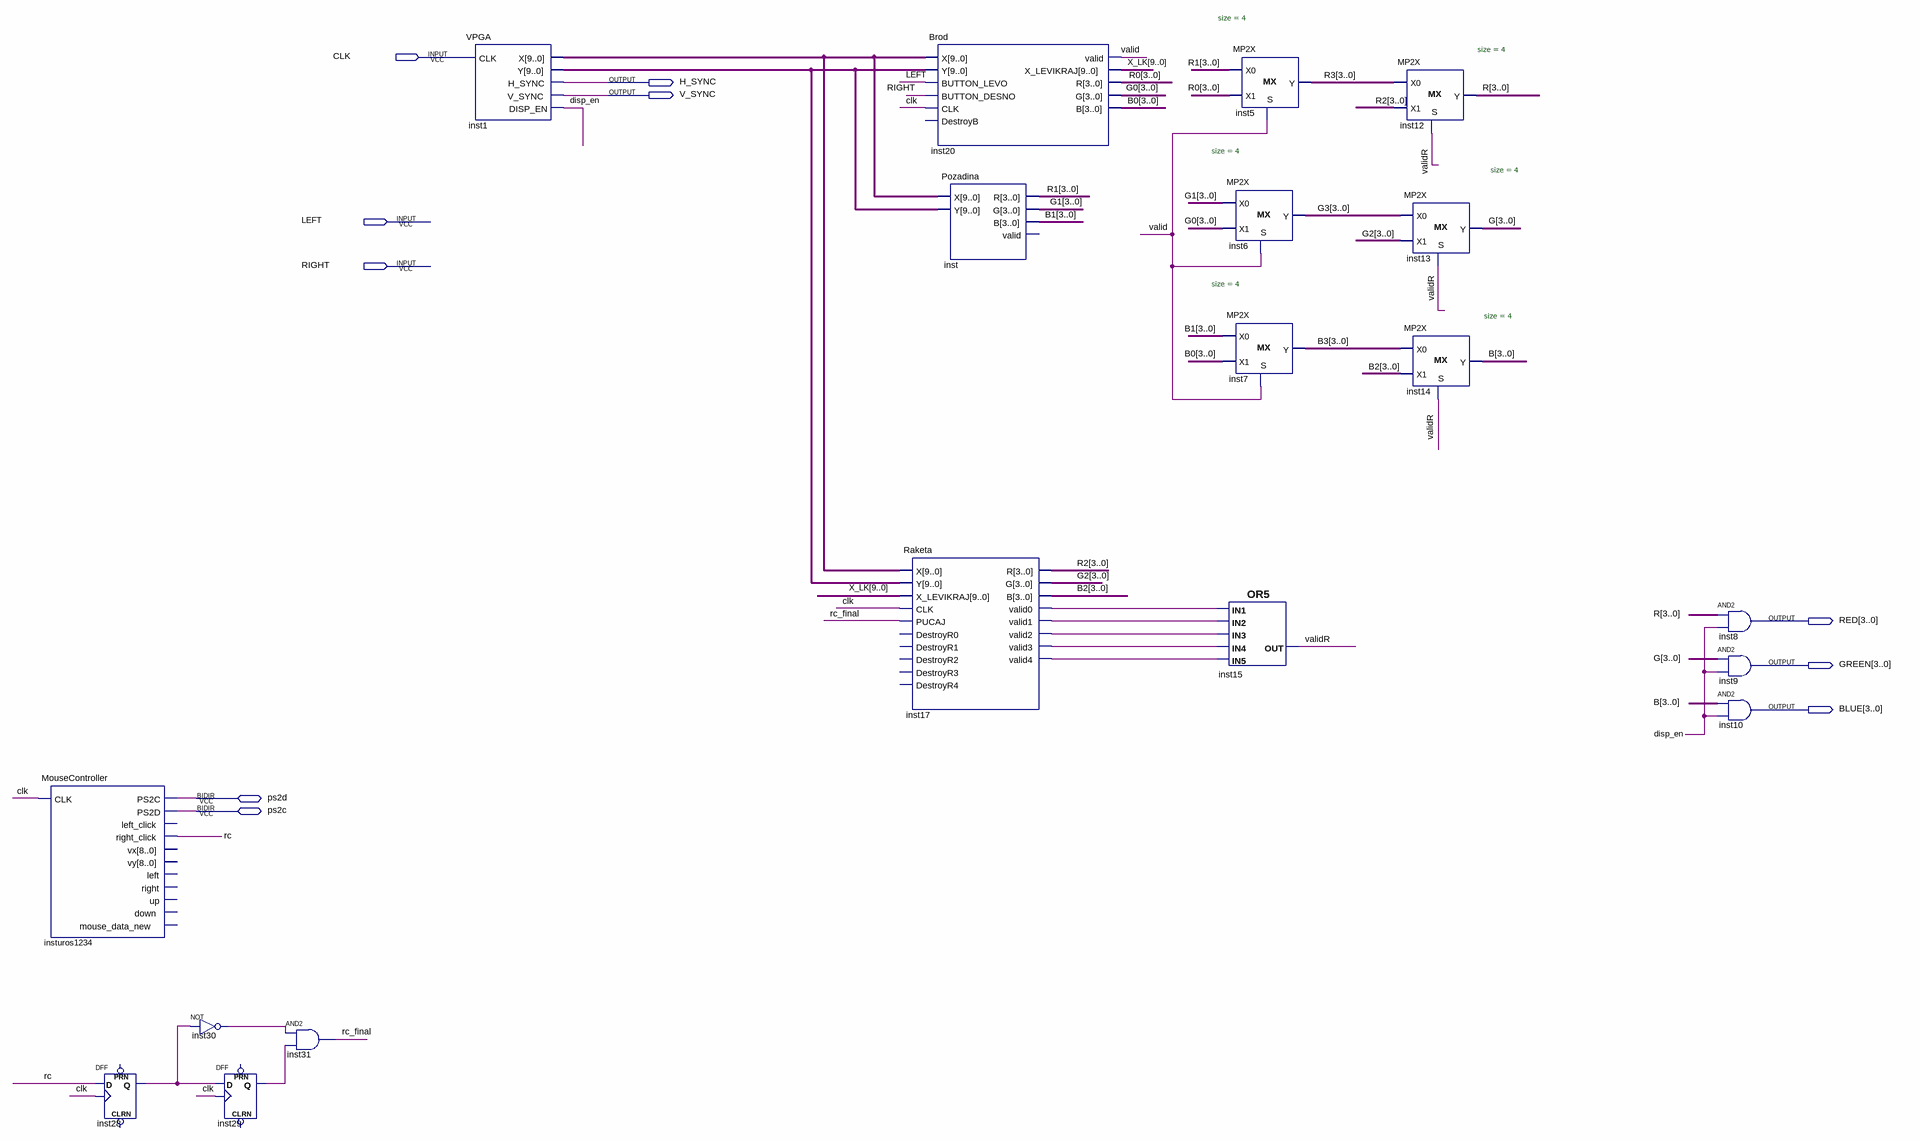
[diagram p0: schematic sheet]
// Quartus schematic Igrica.bdf as structural Verilog: 19 symbols, 10 pins
module Igrica (
  input  CLK,
  input  LEFT,
  input  RIGHT,
  inout  ps2d,
  inout  ps2c,
  output H_SYNC,
  output V_SYNC,
  output [3:0] RED,
  output [3:0] GREEN,
  output [3:0] BLUE
);

  wire disp_en, inst17_valid0, inst17_valid1, inst17_valid2, inst17_valid3, inst17_valid4, inst28_q,
       inst29_q, inst30_out, rc, rc_final, valid, validR;
  wire [3:0] B, B0, B1, B2, B3, G, G0, G1, G2, G3, R, R0, R1, R2, R3;
  wire [9:0] inst1_x, inst1_y, X_LK;

  MouseController insturos1234 (
    .CLK(CLK), .right_click(rc), .PS2C(ps2d), .PS2D(ps2c));  // open: left_click, vx, vy, left, right, up, down, mouse_data_new
  DFF inst28 (.CLK(CLK), .D(rc), .Q(inst28_q));  // open: CLRN, PRN
  not inst30 (inst30_out, inst28_q);
  DFF inst29 (.CLK(CLK), .D(inst28_q), .Q(inst29_q));  // open: CLRN, PRN
  and inst31 (rc_final, inst30_out, inst29_q);
  VPGA inst1 (.CLK(CLK), .X(inst1_x), .Y(inst1_y), .H_SYNC(H_SYNC), .V_SYNC(V_SYNC), .DISP_EN(disp_en));
  Raketa inst17 (
    .X(inst1_x), .Y(inst1_y), .X_LEVIKRAJ(X_LK), .CLK(CLK), .PUCAJ(rc_final), .R(R2), .G(G2), .B(B2),
    .valid0(inst17_valid0), .valid1(inst17_valid1), .valid2(inst17_valid2), .valid3(inst17_valid3),
    .valid4(inst17_valid4));  // open: DestroyR0, DestroyR1, DestroyR2, DestroyR3, DestroyR4
  Brod inst20 (
    .X(inst1_x), .Y(inst1_y), .BUTTON_LEVO(LEFT), .BUTTON_DESNO(RIGHT), .CLK(CLK), .valid(valid),
    .X_LEVIKRAJ(X_LK), .R(R0), .G(G0), .B(B0));  // open: DestroyB
  Pozadina inst (.X(inst1_x), .Y(inst1_y), .R(R1), .G(G1), .B(B1));  // open: valid
  MP2X #(.size(4)) inst5 (.S(valid), .X0(R1), .X1(R0), .Y(R3));
  MP2X #(.size(4)) inst6 (.S(valid), .X0(G1), .X1(G0), .Y(G3));
  MP2X #(.size(4)) inst7 (.S(valid), .X0(B1), .X1(B0), .Y(B3));
  or inst15 (validR, inst17_valid0, inst17_valid1, inst17_valid2, inst17_valid3, inst17_valid4);
  MP2X #(.size(4)) inst12 (.S(validR), .X0(R3), .X1(R2), .Y(R));
  MP2X #(.size(4)) inst13 (.S(validR), .X0(G3), .X1(G2), .Y(G));
  MP2X #(.size(4)) inst14 (.S(validR), .X0(B3), .X1(B2), .Y(B));
  assign RED = R & {4{disp_en}};  // AND2 inst8, 4 bits wide
  assign GREEN = G & {4{disp_en}};  // AND2 inst9, 4 bits wide
  assign BLUE = B & {4{disp_en}};  // AND2 inst10, 4 bits wide
endmodule
